# EAGLE design lcd_octopus_t2313 (EAGLE 6.1)
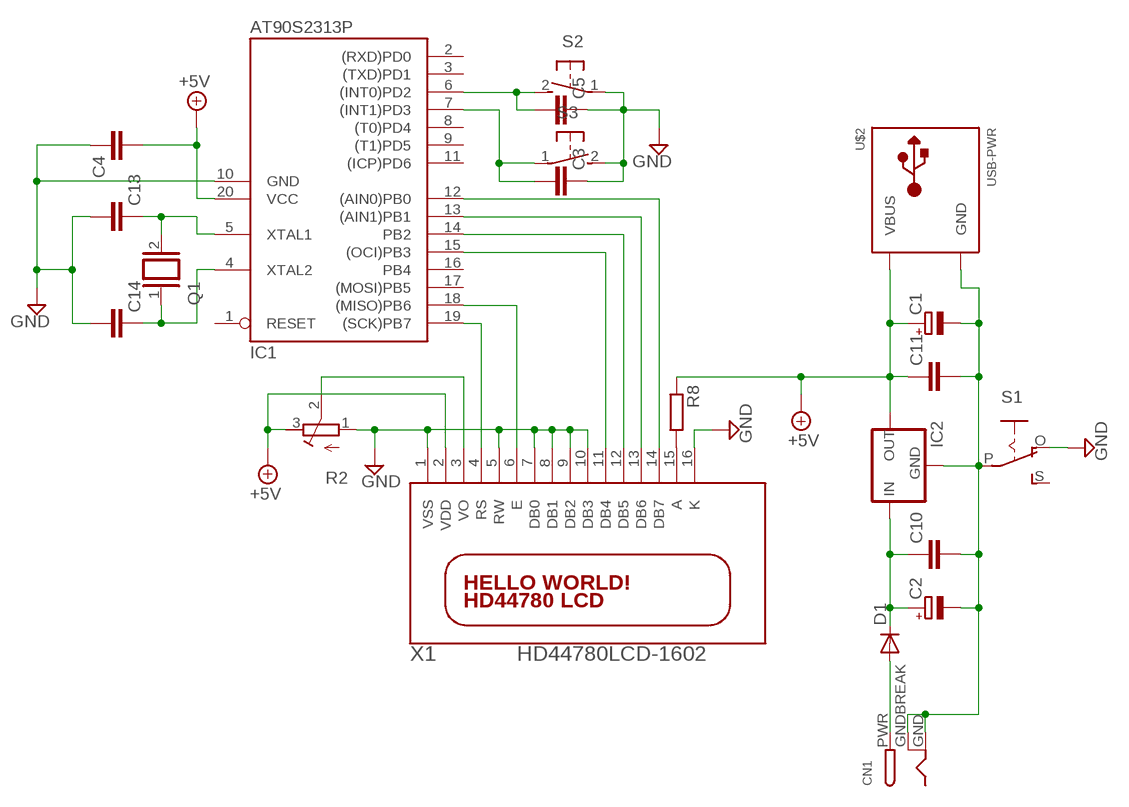
[diagram p0: schematic, sheet 1]

## Parts
C1  CPOL-EUTT2D5L  [TT2D5L]
C2  CPOL-EUTT2D5L  [TT2D5L]
C3  C-EU025-025X050  [C025-025X050]
C4  C-EU025-025X050  [C025-025X050]
C5  C-EU025-025X050  [C025-025X050]
C10  C-EU025-025X050  [C025-025X050]
C11  C-EU025-025X050  [C025-025X050]
C13  C-EU025-025X050  [C025-025X050]
C14  C-EU025-025X050  [C025-025X050]
CN1  DCBARRELPTH  [DCJACK_2MM_PTH]
D1  DIODE-D-2.5  [D-2.5]
IC1  AT90S2313P  [DIL20]
IC2  78XX_V  [78XXV]
Q1  XTAL/S  [QS]
R2  R-TRIMM3339P  [RTRIM3339P]
R8  R-EU_0207/10  [0207/10]
S1  EG1218S  [EG1218]
S2  31-XX  [B3F-31XX]
S3  31-XX  [B3F-31XX]
U$2  USB-PWR  [USB-MINIB-THM-MOLEX-PWRONLY]
X1  HD44780LCD-1602  [LCD1602]

## Nets
+5V: C1.+ C4.2 C11.1 IC1.20(VCC) IC2.OUT R2.3(E) R8.1 U$2.VBUS X1.2(VDD)
EN: IC1.18((MISO)PB6) X1.6(E)
GND: C3.1 C4.1 C5.1 C13.2 C14.2 IC1.10(GND) R2.1(A) S1.O S2.1(P) S3.2(S) X1.1(VSS) X1.5(RW) X1.7(DB0) X1.8(DB1) X1.9(DB2) X1.10(DB3) X1.16(K)
N$1: C2.+ C10.1 D1.C IC2.IN
N$2: IC1.19((SCK)PB7) X1.4(RS)
N$3: IC1.15((OCI)PB3) X1.11(DB4)
N$4: IC1.14(PB2) X1.12(DB5)
N$5: R8.2 X1.15(A)
N$6: IC1.13((AIN1)PB1) X1.13(DB6)
N$7: IC1.12((AIN0)PB0) X1.14(DB7)
N$8: R2.2(S) X1.3(VO)
N$9: C1.- C2.- C10.2 C11.2 CN1.GND CN1.GNDBREAK IC2.GND S1.P U$2.GND
N$10: C3.2 IC1.7((INT1)PD3) S3.1(P)
N$11: C13.1 IC1.5(XTAL1) Q1.2
N$12: C5.2 IC1.6((INT0)PD2) S2.2(S)
N$13: C14.1 IC1.4(XTAL2) Q1.1
N$14: CN1.PWR D1.A
Unconnected: IC1.1(RESET) IC1.2((RXD)PD0) IC1.3((TXD)PD1) IC1.8((T0)PD4) IC1.9((T1)PD5) IC1.11((ICP)PD6) IC1.16(PB4) IC1.17((MOSI)PB5) S1.S

## Library data of the parts
C1 C2 = rcl:CPOL-EU: POLARIZED CAPACITOR, European symbol
C3-C5 C10 C11 C13 C14 = rcl:C-EU: CAPACITOR, European symbol
CN1 = adafruit:DCBARREL: 2.0mm DC Barrel Jack DCJACK_2MM_PTH - Through Hole Jack (4UConnector: 05537)
D1 = diode:DIODE-: DIODE
IC1 = atmel:AT90S2313: MICROCONTROLLER 2 Kbytes FLASH 128 bytes SRAM 128 bytes EEPROM UART; OC_FARNELL: unknown; OC_NEWARK: unknown
IC2 = mbed-ics:78XX: VOLTAGE REGULATOR
Q1 = special:XTAL/S: CRYSTAL
R2 = rcl:R-TRIMM: Trimm resistor
R8 = rcl:R-EU_: RESISTOR, European symbol
S1 = adafruit:EG1218: SLIDING SWITCH 0.1" spacing through hole, vertical SPDT slide switch http://www.ladyada.net/library/pcb/eaglelibrary.html
S2 S3 = adafruit:31-XX: OMRON SWITCH Now with beefier pads!
U$2 = adafruit:USB-PWR
X1 = adafruit:HD44780LCD: HD44780 LCD Standard character type LCDs, available in sizes from 8x1 to 40x4!

## Board
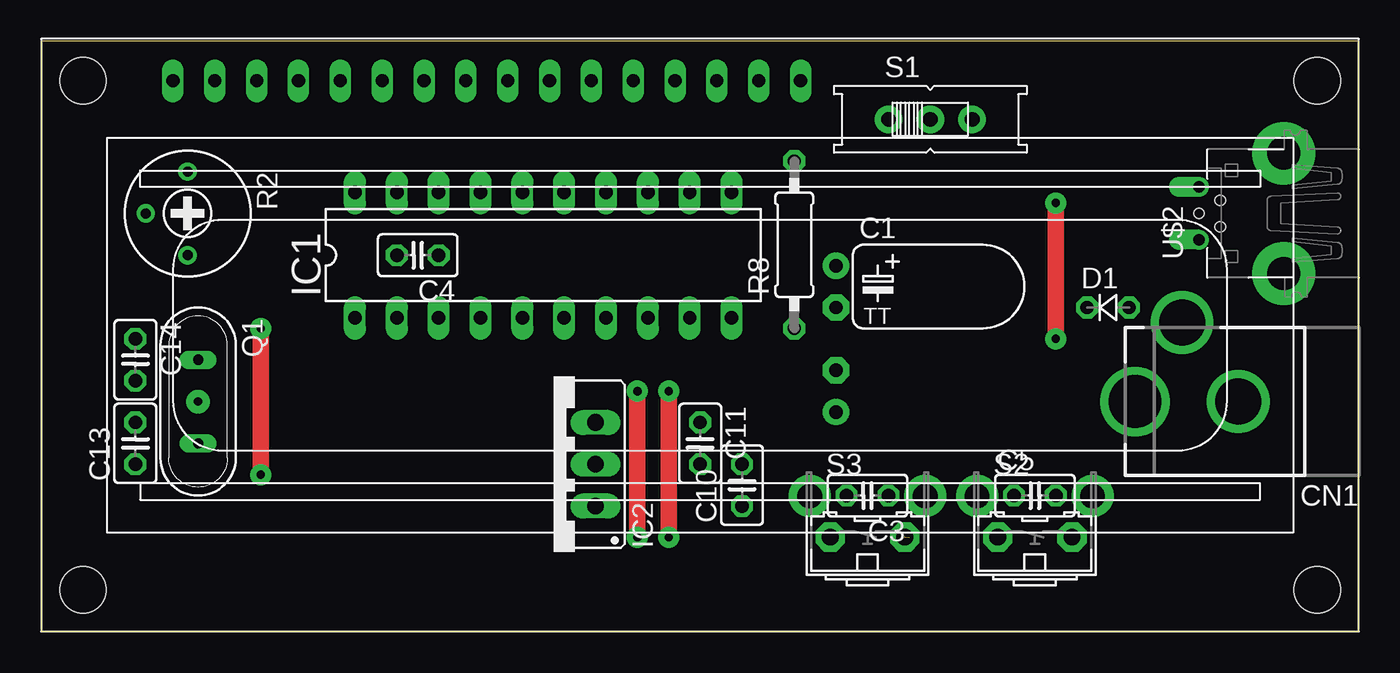
[diagram p1: board, top side]
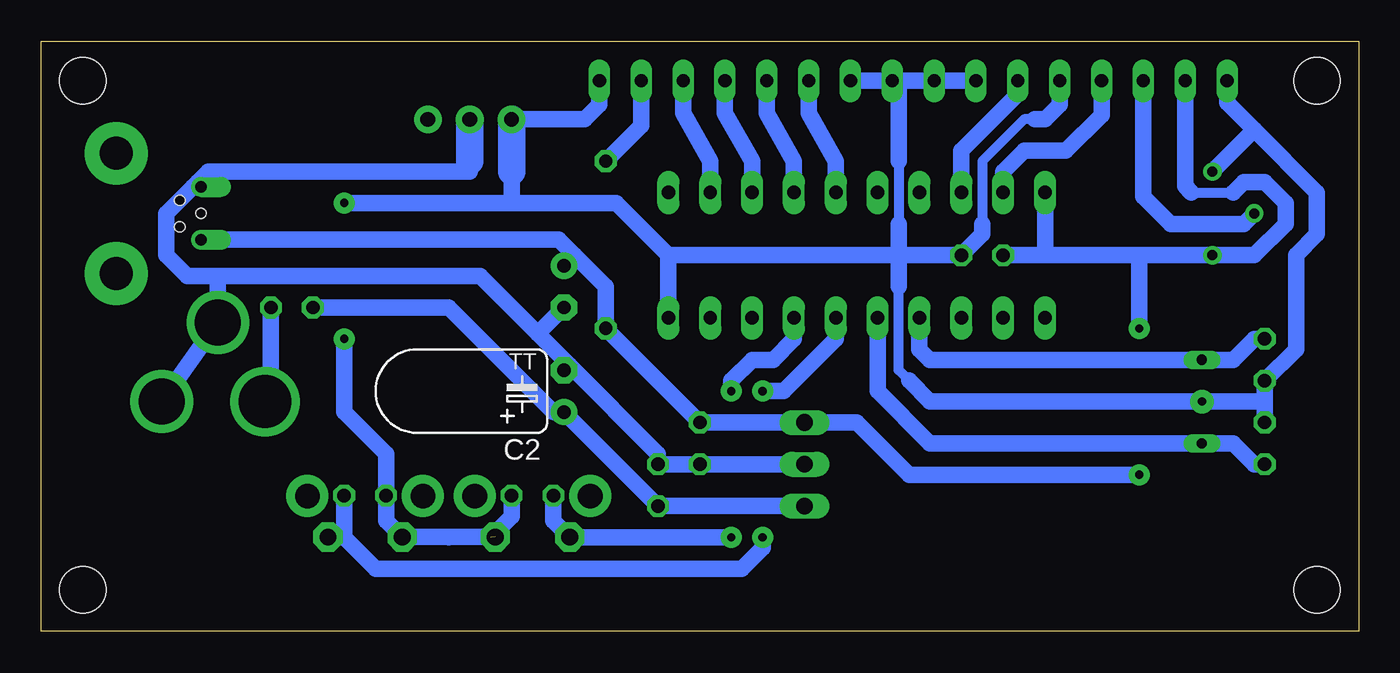
[diagram p2: board, bottom side, seen from below]

Size 79.99 x 35.87 mm. Coordinates in mm from the lower left corner, seen from the top.
Outline: 0,0 79.99,0 79.99,35.87 0,35.87 0,0
Copper layers (1*16): Top 0.035mm / dielectric 1.5mm / Bottom 0.035mm
Design rules: minimum track width 10mil, minimum drill 24mil, track to track 8mil, track to pad 8mil, pad to pad 8mil, via to via 8mil, smd to smd 8mil, copper to edge 40mil, drill to drill 8mil, minimum pad ring 10mil, minimum via ring 8mil, stop-mask expansion 4mil, vias tented up to drill 0mil, thermal gap 10mil

### Footprints (pad centres in the part's own frame; a part is rotated, then mirrored left to right if it is on the bottom)
TT2D5L = drill 0.813 pad 1.6: + -1.27,0 | drill 0.813 pad 1.6 octagon: - 1.27,0
C025-025X050 = drill 0.813 octagon: 1 -1.27,0; 2 1.27,0
DCJACK_2MM_PTH = drill 2.8: GND 0,7.35; GNDBREAK 4.8,10.75 | drill 3.2: PWR 0,13.6
D-2.5 = drill 0.813 octagon: A 1.27,0; C -1.27,0
DIL20 = drill 0.813 long: 1 -11.43,-3.81; 2 -8.89,-3.81; 3 -6.35,-3.81; 4 -3.81,-3.81; 5 -1.27,-3.81; 6 1.27,-3.81; 7 3.81,-3.81; 8 6.35,-3.81; 9 8.89,-3.81; 10 11.43,-3.81; 11 11.43,3.81; 12 8.89,3.81; 13 6.35,3.81; 14 3.81,3.81; 15 1.27,3.81; 16 -1.27,3.81; 17 -3.81,3.81; 18 -6.35,3.81; 19 -8.89,3.81; 20 -11.43,3.81
78XXV = drill 1.016 long: GND 0,-2.54; IN -2.54,-2.54; OUT 2.54,-2.54
QS = drill 0.61 long: 1 -2.54,0; 2 2.54,0
RTRIM3339P = drill 0.61: 1 -2.54,0; 2 0,-2.54; 3 2.54,0
0207/10 = drill 0.813 octagon: 1 -5.08,0; 2 5.08,0
EG1218 = drill 0.9 pad 1.676: O -2.54,0; P 0,0; S 2.54,0
B3F-31XX = drill 1.016 pad 1.778 octagon: 1 -2.261,-1.245; 2 2.261,-1.245 | drill 1.499 pad 2.54: 3 -3.505,1.245; 4 3.505,1.245
USB-MINIB-THM-MOLEX-PWRONLY = drill 0.7 offset: GND 1.6,4.64; VBUS -1.6,4.64 | drill 2 pad 3.81: GND1 -3.65,-0.51; GND4 3.65,-0.51 | hole 0.6: 0,4.648; 0.787,3.353; -0.813,3.353
LCD1602 = drill 0.8 long: 1 8,33.46; 2 10.54,33.46; 3 13.08,33.46; 4 15.62,33.46; 5 18.16,33.46; 6 20.7,33.46; 7 23.24,33.46; 8 25.78,33.46; 9 28.32,33.46; 10 30.86,33.46; 11 33.4,33.46; 12 35.94,33.46; 13 38.48,33.46; 14 41.02,33.46; 15 43.56,33.46; 16 46.1,33.46 | hole 2.8: 2.54,2.54; 2.54,33.46; 77.46,33.46; 77.46,2.54

### Placement (x,y rotation side)
C1  48.26,20.95 270 top
C2  48.26,14.61 90 bottom
C3  50.16,8.26 180 top
C4  22.86,22.86 180 top
C5  60.33,8.26 0 top
C10  42.55,8.89 90 top
C11  40.01,11.43 270 top
C13  5.71,11.43 90 top
C14  5.71,16.51 270 top
CN1  80.01,13.97 90 top
D1  64.77,19.68 0 top
IC1  30.48,22.86 0 top
IC2  31.11,10.16 90 top
Q1  9.53,13.97 270 top
R2  8.89,25.4 270 top
R8  45.72,23.5 90 top
S1  53.98,31.11 0 top
S2  60.33,6.99 0 top
S3  50.16,6.99 0 top
U$2  74.93,25.4 90 top
X1  0,0 0 top

### Tracks (layer width: path | path; a pad name or v marks a point on that pad's centre or on a via)
+5V  (via drill 0.5 pad 1.27)
  Top 1.016: v13.34,9.53 v13.34,18.41
  Bottom 0.61: 10.16,26.67 7.62,26.67
  Bottom 1.016: v13.34,9.53 27.3,9.53 30.48,12.7 IC2.OUT C11.1 R8.1 45.72,20.95 47.62,22.86 | 7.62,26.67 6.99,27.3 5.71,27.3 4.45,26.04 4.45,24.77 6.35,22.86 R2.3 13.34,22.86 | 19.05,22.86 C4.2 | IC1.20 19.05,22.86 | X1.2 10.54,27.05 10.16,26.67 | 19.05,22.86 13.34,22.86 | 13.34,22.86 v13.34,18.41 | U$2.VBUS 48.56,23.8 47.62,22.86 | C1.+ 47.62,22.86
EN
  Bottom 1.016: X1.6 20.7,32.64 24.13,29.21 IC1.18
GND  (via drill 0.5 pad 1.27, 0.5 pad 1.42)  (1 unrouted)
  Top 1.016: v61.59,17.78 v61.59,26.04
  Bottom 0.61: 22.86,24.77 22.86,28.57 20.32,31.11 19.68,31.11 | 27.94,28.57 27.94,24.77 | 27.3,15.24 27.94,15.88 27.94,20.95
  Bottom 1.016: 27.94,33.46 X1.8 X1.7 | 27.94,33.46 X1.9 X1.10 | 27.94,33.46 27.94,28.57 | 27.94,24.77 27.94,22.86 | 27.94,20.95 27.94,22.86 | IC1.10 41.91,22.86 | 6.35,30.48 2.54,26.67 2.54,24.13 3.81,22.86 3.81,17.14 C14.2 5.71,13.97 | R2.1 6.35,30.48 | 5.71,13.97 C13.2 | 27.94,22.86 C4.1 22.86,24.13 22.86,24.77 | S3.2 S2.1 | S2.1 58.4,5.74 58.42,5.71 | X1.16 46.1,32.01 46.99,31.11 S1.O | S3.2 55.22,5.74 55.24,5.71 | S3.2 55.24,5.74 | v61.59,26.04 51.44,26.04 | 27.94,22.86 41.91,22.86 | 51.44,27.94 51.44,26.04 | X1.1 8,32.13 6.35,30.48 | C3.1 51.44,6.99 52.7,5.71 | S2.1 59.05,6.73 C5.1 59.05,10.79 61.59,13.34 v61.59,17.78 | 5.71,13.97 v9.53,13.97 26.04,13.97 27.3,15.24 | X1.5 18.16,32.01 19.05,31.11 19.68,31.11 | 51.44,26.04 45.09,26.04 41.91,22.86
  Bottom 1.676: S1.O 51.44,27.94
N$1
  Bottom 1.016: IC2.IN C10.1 C2.+ 48.9,13.34 55.24,19.68 D1.C
N$2
  Bottom 1.016: X1.4 15.62,31.37 17.78,29.21 20.32,29.21 21.59,27.94 IC1.19
N$3
  Bottom 1.016: X1.11 33.4,31.5 31.75,28.57 IC1.15
N$4
  Bottom 1.016: X1.12 35.94,31.5 34.29,28.57 IC1.14
N$5
  Bottom 1.016: X1.15 43.56,30.73 R8.2
N$6
  Bottom 1.016: X1.13 38.48,31.5 36.83,28.57 IC1.13
N$7
  Bottom 1.016: X1.14 41.02,31.5 39.37,28.57 IC1.12
N$8
  Bottom 1.016: R2.2 6.99,24.77 11.43,24.77 13.08,26.41 X1.3
N$9
  Bottom 1.016: 70.79,27 U$2.GND 70.29,27.11 70.48,27.3 | 70.79,27 72.39,25.4 72.39,22.86 71.12,21.59 69.22,21.59 | IC2.GND C11.2 C10.2 42.55,10.79 47.94,16.19 | 70.79,27 69.85,27.94 53.98,27.94 53.98,28.57 | 69.22,21.59 69.26,21.55 CN1.GNDBREAK CN1.GND | 69.22,21.59 53.34,21.59 49.85,18.1 | 47.94,16.19 49.85,18.1 | C1.- 49.85,18.1 | C2.- 47.94,16.19
  Bottom 1.676: S1.P 53.98,28.57
N$10  (via drill 0.5 pad 1.27)
  Top 1.016: v38.1,14.61 v38.1,5.71
  Bottom 1.016: IC1.7 34.29,17.78 35.56,16.51 36.83,16.51 38.1,15.24 v38.1,14.61 | C3.2 48.9,6.73 S3.1 47.88,5.71 v38.1,5.71
N$11
  Bottom 1.016: C13.1 6.35,10.16 7.62,11.43 8.26,11.43 Q1.2 26.04,11.43 29.21,14.61 IC1.5
N$12  (via drill 0.5 pad 1.27)
  Top 1.016: v36.2,14.61 v36.2,5.71
  Bottom 1.016: IC1.6 31.75,17.78 34.92,14.61 v36.2,14.61 | v36.2,5.71 36.2,5.08 37.47,3.81 59.69,3.81 61.59,5.71 | C5.2 61.59,5.71 | 61.59,5.71 62.23,5.71 | 62.23,5.71 62.87,5.71 | S2.2 62.26,5.74 62.23,5.71
N$13
  Bottom 1.016: 26.67,18.41 IC1.4 26.67,17.14 26.04,16.51 Q1.1 7.62,16.51 6.35,17.78 C14.1
N$14
  Bottom 1.016: CN1.PWR 66.04,14.34 D1.A